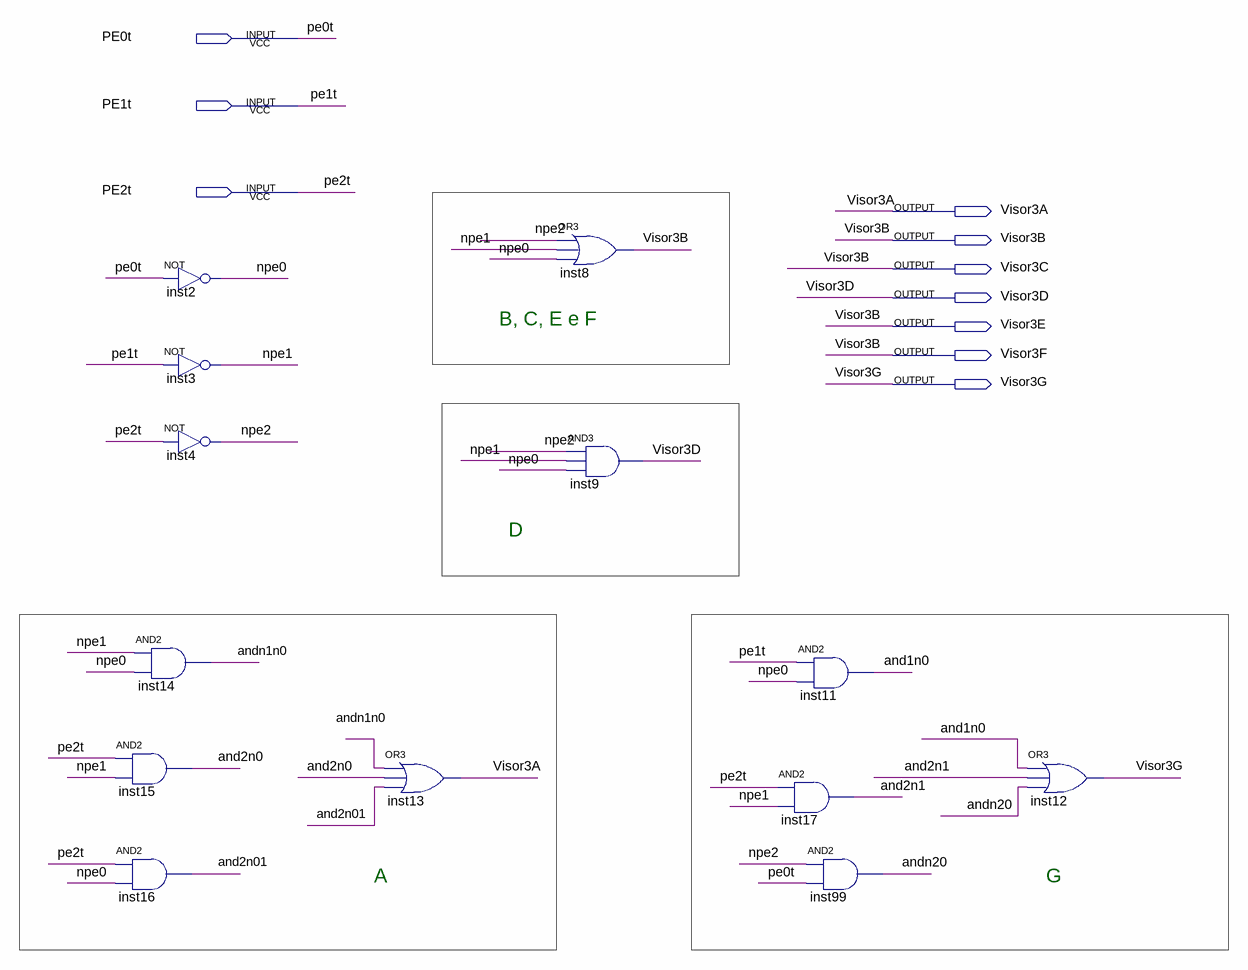
[diagram p0: schematic sheet]
// Quartus schematic Visor3.bdf as structural Verilog: 13 symbols, 10 pins
module Visor3 (
  input  PE0t,
  input  PE1t,
  input  PE2t,
  output Visor3A,
  output Visor3B,
  output Visor3C,
  output Visor3D,
  output Visor3E,
  output Visor3F,
  output Visor3G
);

  wire and1n0, and2n0, and2n1, and2n01, andn1n0, andn20, npe0, npe1, npe2;

  and inst15 (and2n0, PE2t, npe1);
  and inst16 (and2n01, PE2t, npe0);
  not inst2 (npe0, PE0t);
  not inst3 (npe1, PE1t);
  not inst4 (npe2, PE2t);
  and inst14 (andn1n0, npe1, npe0);
  or inst13 (Visor3A, andn1n0, and2n0, and2n01);
  or inst8 (Visor3B, npe2, npe1, npe0);
  and inst9 (Visor3D, npe2, npe1, npe0);
  and inst11 (and1n0, PE1t, npe0);
  and inst17 (and2n1, PE2t, npe1);
  and inst99 (andn20, npe2, PE0t);
  or inst12 (Visor3G, and1n0, and2n1, andn20);

  assign Visor3C = Visor3B;
  assign Visor3E = Visor3B;
  assign Visor3F = Visor3B;

  // Notes on the sheet:
  //   B, C, E e F
  //   D
  //   A
  //   G
endmodule
